# Altium schematic sheet PDM_MCU_STM32F407GT6.SchDoc
size A; SheetNumber: 3; SheetTotal: 4
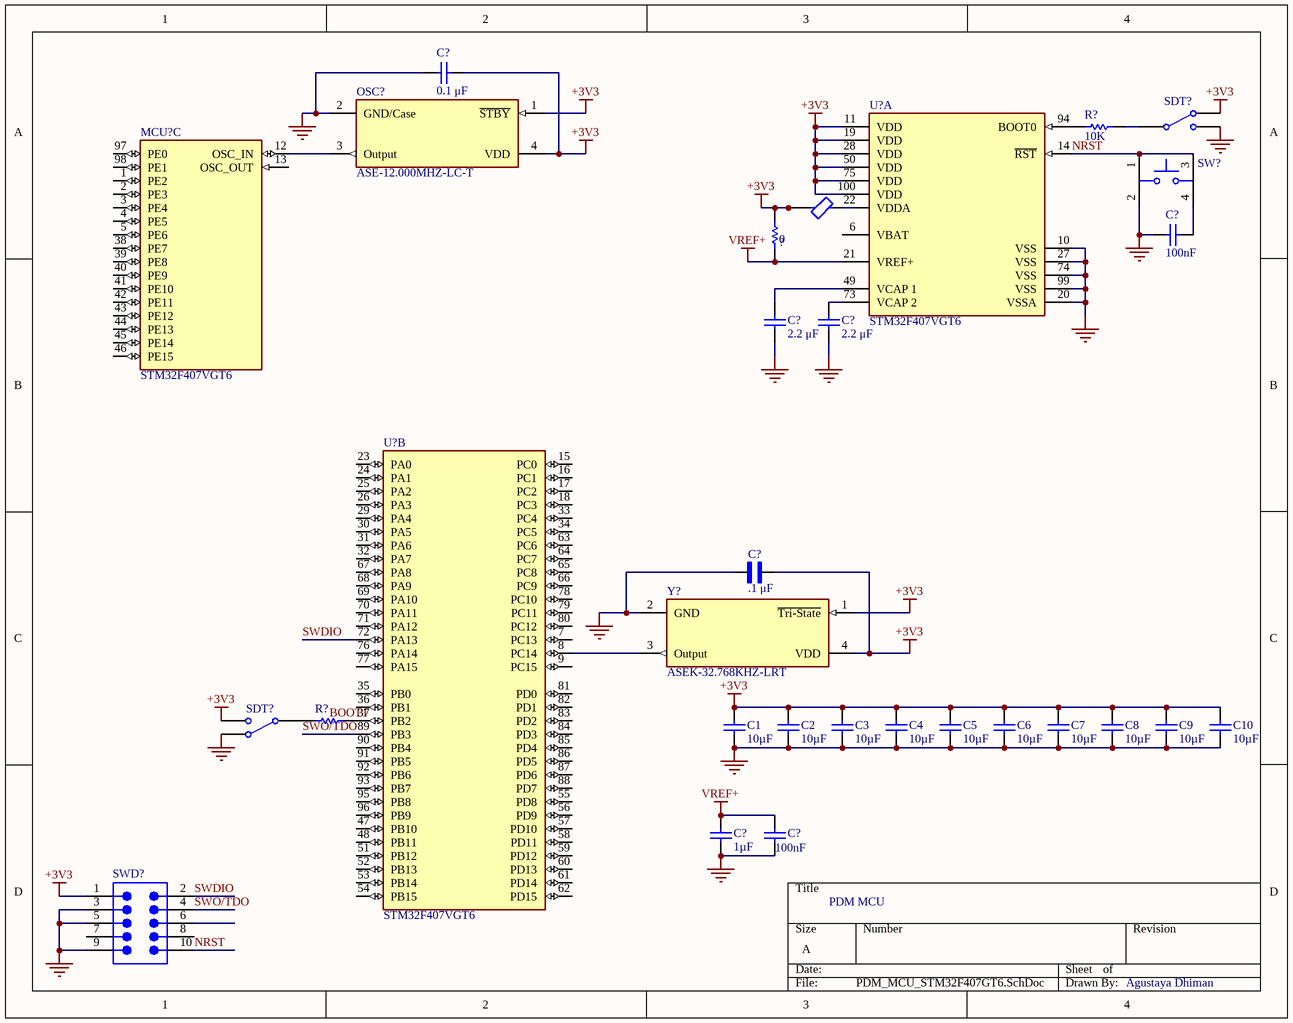
[diagram p0: PDM_MCU_STM32F407GT6.SchDoc]

## Parts
(Parts that share a designator on the sheet are numbered #1, #2 ... from top to bottom, then left to right.)
?  value 0  (hidden comment: Resistor)
C1  value 10µF  (hidden comment: Capacitor)
C2  value 10µF  (hidden comment: Capacitor)
C3  value 10µF  (hidden comment: Capacitor)
C4  value 10µF  (hidden comment: Capacitor)
C5  value 10µF  (hidden comment: Capacitor)
C6  value 10µF  (hidden comment: Capacitor)
C7  value 10µF  (hidden comment: Capacitor)
C8  value 10µF  (hidden comment: Capacitor)
C9  value 10µF  (hidden comment: Capacitor)
C10  value 10µF  (hidden comment: Capacitor)
C?#1  value 0.1 μF  (hidden comment: Capacitor)
C?#2  value 100nF  (hidden comment: Capacitor)
C?#3  value 2.2 μF  (hidden comment: Capacitor)
C?#4  value 2.2 μF  (hidden comment: Capacitor)
C?#5  .1 μF  [CAP_0603-Footprint]
C?#6  value 1µF  (hidden comment: Capacitor)
C?#7  value 100nF  (hidden comment: Capacitor)
FB?  BLM03BB750SZ1D  [FP-BLM03-0_03-d0_3-IPC_C]  (value not drawn)
MCU?  STM32F407VGT6  [FP-LQFP100-1L-MFG]  (part C of 3)
OSC?  ASE-12.000MHZ-LC-T  [FP-ASE-MFG]
R?#1  value 10K  (hidden comment: Resistor)
R?#2  Resistor  (value not drawn)
SDT?#1  Single-Pole, Double-Throw Switch  (value not drawn)
SDT?#2  Single-Pole, Double-Throw Switch  (value not drawn)
SW?  KT11P3JM34LFS  [FP-KT11P3JM34LFS-MFG]  (value not drawn)
SWD?  LTMM-105-02-T-D-SM  [SMTC-LTMM-105-02-X-D-SM]  (value not drawn)
U?#1  STM32F407VGT6  [FP-LQFP100-1L-MFG]  (part A of 3)
U?#2  STM32F407VGT6  [FP-LQFP100-1L-MFG]  (part B of 3)
Y?  ASEK-32.768KHZ-LRT  [FP-ASEK-ASEAIG-MFG]

## Nets
+3V3: ?.1 C1.2 C2.2 C3.2 C4.2 C5.2 C6.2 C7.2 C8.2 C9.2 C10.2 C?#1.2 C?#5.2 FB?.2 OSC?.1(~{STBY}) OSC?.4(VDD) SDT?#1.3 SDT?#2.2 SWD?.1 U?#1.11(VDD) U?#1.19(VDD) U?#1.28(VDD) U?#1.50(VDD) U?#1.75(VDD) U?#1.100(VDD) Y?.1(~{Tri-State}) Y?.4(VDD)
\: C?#1.1 C?#2.2 C?#5.1 OSC?.2(GND/Case) SW?.2 Y?.2(GND)
GND: C?#3.2 C?#4.2 SDT?#1.2 U?#1.10(VSS) U?#1.20(VSSA) U?#1.27(VSS) U?#1.74(VSS) U?#1.99(VSS)
NetC1_1: C1.1 C2.1 C3.1 C4.1 C5.1 C6.1 C7.1 C8.1 C9.1 C10.1 C?#6.1 C?#7.1 SDT?#2.3 SWD?.3 SWD?.5 SWD?.9
VREF+: ?.2 C?#6.2 C?#7.2 U?#1.21(VREF+)
NRST: SW?.1 SW?.3 SWD?.10 U?#1.14(~{RST})
SWDIO: SWD?.2 U?#2.72(PA13)
SWO/TDO: SWD?.4 U?#2.89(PB3)
NetC?#2_1: C?#2.1 SW?.4
NetC?#3_1: C?#3.1 U?#1.49(VCAP_1)
NetC?#4_1: C?#4.1 U?#1.73(VCAP_2)
NetFB?_1: FB?.1 U?#1.22(VDDA)
NetMCU?_12: MCU?.12(OSC_IN) OSC?.3(Output)
NetR?#1_1: R?#1.1 U?#1.94(BOOT0)
NetR?#1_2: R?#1.2 SDT?#1.1
NetR?#2_1: R?#2.1 SDT?#2.1
NetR?#2_2: R?#2.2 U?#2.37(PB2)
NetU?#2_8: U?#2.8(PC14) Y?.3(Output)

Not connected (* = marked no-connect by the designer): MCU? 1(PE2) 2(PE3) 3(PE4) 4(PE5) 5(PE6) 13(OSC_OUT) 38(PE7) 39(PE8) 40(PE9) 41(PE10) 42(PE11) 43(PE12) 44(PE13) 45(PE14) 46(PE15) 97(PE0) 98(PE1); SWD? 6 7 8; U?#1 6(VBAT); U?#2 7(PC13) 9(PC15) 15(PC0) 16(PC1) 17(PC2) 18(PC3) 23(PA0) 24(PA1) 25(PA2) 26(PA3) 29(PA4) 30(PA5) 31(PA6) 32(PA7) 33(PC4) 34(PC5) 35(PB0) 36(PB1) 47(PB10) 48(PB11) 51(PB12) 52(PB13) 53(PB14) 54(PB15) 55(PD8) 56(PD9) 57(PD10) 58(PD11) 59(PD12) 60(PD13) 61(PD14) 62(PD15) 63(PC6) 64(PC7) 65(PC8) 66(PC9) 67(PA8) 68(PA9) 69(PA10) 70(PA11) 71(PA12) 76(PA14) 77(PA15) 78(PC10) 79(PC11) 80(PC12) 81(PD0) 82(PD1) 83(PD2) 84(PD3) 85(PD4) 86(PD5) 87(PD6) 88(PD7) 90(PB4) 91(PB5) 92(PB6) 93(PB7) 95(PB8) 96(PB9)

## Notes on the sheet
- PDM MCU
- Agustaya Dhiman
- Labels drawn without touching a wire or pin: BOOT1

## Library data of the parts
? = Resistor: SimulationGenericComponent: True; TC1: 0; TC2: 0
C1-C10 C?#1-C?#4 C?#6 C?#7 = Capacitor: SimulationGenericComponent: True
C?#5 = CMP-022-000000-4: 0.1µF ±10% 50V Ceramic 0603; Manufacturer Part Number 1: CL10B104KB8NNNC; Manufacturer 1: Samsung Electro-Mechanics
FB? = CMP-06046-002018-1: Ferrite Bead, 0201, 75Ω @ 100MHz, 25%, 1Ω, 200mA; DC Resistance (DCR): 1R; Number of Lines: 1; Ratings: AEC-Q200; Max Current Rating: 200mA; Min Operating Temperature: -55°C; Max Operating Temperature: 125°C; RoHS Compliant: Yes; Case/Package: 0201; Mount: Surface Mount
MCU? U?#1 U?#2 = CMP-0243-00017-5: NexarPartId: 20570110; Manufacturer Package Identifier: 1L_ME_V5; Peripherals: Brown-out Detect/Reset, DMA, I2C, LCD, POR, PWM, WDT; Number of Programmable I/O: 82; Oscillator Type: Internal; Nominal Supply Current: 1.7µA; Number of Timers/Counters: 14; RAM Size: 192kB; Number of D/A Converters: 2; Number of Ethernet Channels: 1; Max Frequency: 168MHz; Number of SPI Channels: 3; Data Bus Width: 32b; Number of ADC Channels: 16; Max Supply Voltage: 3.6V; Number of USART Channels: 4; Interface: CAN, Ethernet, I2C, I2S, IrDA, LIN, SPI, UART, USART, USB; Max Junction Temperature (Tj): 125°C; Core Architecture: ARM Cortex-M4; Watchdog Timer: Yes; Memory Size: 1MB; Memory Type: FLASH; Min Supply Voltage: 1.8V; Number of I/Os: 82; Lead Free: Lead Free; Lifecycle Status: Production; Radiation Hardening: No; Frequency: 168MHz; Max Operating Temperature: 85°C; Height: 1.45mm; Number of Pins: 100; Number of I2C Channels: 3; Number of USB Channels: 1; REACH SVHC: No SVHC; Length: 14.2mm; Ambient Temperature Range High: 85°C; Schedule B: 8542310000, 8542310000; Number of Channels: 16; Number of A/D Converters: 3; Width: 14.2mm; Case/Package: LQFP; Flash Memory Size: 1MB; Min Operating Temperature: -40°C; Address Bus Width: 32b; Number of UART Channels: 2; RoHS: Compliant; Number of PWM Channels: 2
OSC? = CMP-27762-006076-1: XTAL Oscillator 12MHz ±50ppm CMOS 3.3V 4-SMD 3.2mm x 2.5mm; Load Capacitance: 15pF; Min Supply Voltage: 3.135V; Max Supply Current: 7mA; Max Supply Voltage: 3.465V; Series: ASE; Number of Pins: 4; Operating Frequency: 12 MHz; Operating Supply Voltage: 3.3V; Packaging: Tape and Reel; Package Quantity: 1000; Lead Free: Lead Free; REACH SVHC: No SVHC; Max Operating Temperature: 85°C; Frequency: 12MHz; Height: 0.047inch; Frequency Stability: 50ppm; Length: 3.2mm; Width: 0.098inch; Radiation Hardening: No; Mount: Surface Mount; Termination: SMD/SMT; Depth: 2.5mm; Case/Package: SMD/SMT; Min Operating Temperature: -40°C
R?#1 = Resistor: TC1: 0; SimulationGenericComponent: True; TC2: 0
R?#2 = Resistor: TC1: 0; SimulationGenericComponent: True; Value: 10K; TC2: 0
SDT?#1 SDT?#2 = SPDT SW: nodeUP_closed: 1; Rclosed: 1m; Ropen: 1Meg; SimulationGenericComponent: True
SW? = CMP-10040-000015-1: SWITCH TACTILE SPST-NO 1VA 32V; Manufacturer: C&K Components; Operating Force: 300gf; Standoff Height: 0.14mm; Electromechanical Life: 100000Cycles; Contact Resistance: 50mΩ; Throw Configuration: SPST-NO; Temperature: -40°C to +90°C; Mount: Surface Mount; Voltage Rating Dc: 32V; Automotive: No; Category: Switch; RoHS: TRUE; Mouser Description: Tactile Switches 1.12Mm Silvr J-Lead; Height: 4.1mm; Device Class L2: Switches; Voltage Rating Ac: 32V; Lead Free: Yes; Digikey Description: SWITCH TACTILE SPST-NO 1VA 32V; Temperature Range Low: -40°C; Manufacturer Part Number: KT11P3JM34LFS; ComponentLink2URL: https://dznh3ojzb2azq.cloudfront.net/products/Tactile/KT/documents/datasheet.pdf; Package: 0; Octopart: https://octopart.com/kt11p3jm34lfs-c%26k+components-55425764; ComponentLink2Description: Datasheet; Device Class L3: Tactile Switches; Temperature Range High: +90°C; Device Class L1: Electromechanical
SWD? = CMP-1028-00001-1: Shrouded Header & Stacker, Surface Mount, Vertical, -55 to 105 degC, 2 mm Pitch, 10-Pin, Male, RoHS; Manufacturer: Samtec; Pitch: 2 mm; Temperature Range: -55 to 105 degC; ComponentLink2URL: http://d2a072wq521u33.cloudfront.net/catalog_english//LTMM.PDF; ComponentLink1URL: http://www.samtec.com; ComponentLink3Description: Package Specification; ComponentLink3URL: http://www.samtec.com/documents/webfiles/cpdf/LTMM-1XX-XX-XX-D-XX-XX-MKT.pdf; ComponentLink1Description: Manufacturer URL; Orientation: Vertical; PackageVersion: AQ, 5/1992; PartNumber: LTMM-105-02-T-D-SM; PackageDescription: LTMM Assembly; DatasheetVersion: F-214; PackageReference: LTMM-105-02-X-D-SM; RoHS: True; ComponentLink2Description: Datasheet; Mounting Technology: Surface Mount
Y? = CMP-27762-000009-3: XTAL Oscillator 32.768kHz ±25ppm CMOS 3.3V 4-SMD 3.2mm x 2.5mm; Max Supply Current: 3.5mA; Min Supply Voltage: 2.97V; Load Capacitance: 15pF; Max Supply Voltage: 3.63V; Series: ASEK; Frequency: 32.768kHz; Operating Supply Voltage: 3.3V; Max Operating Temperature: 85°C; Case/Package: SMD/SMT; Frequency Stability: 25ppm; Depth: 2.5mm; Lead Free: Lead Free; Min Operating Temperature: -40°C; Termination: SMD/SMT; Length: 3.2mm; REACH SVHC: No SVHC; Mount: Surface Mount; Number of Pins: 4; Radiation Hardening: No; Operating Frequency: 32.768 kHz; Height: 0.047inch; Packaging: Tape and Reel; Width: 0.098inch